# Altium project eRTM15_Baikal.PrjPCB (part 3 of 4)

## Sheet LvpeclTermWithCtrl.SchDoc: =ProjectName
size 420 x 297 mm; Author: SBH; CompanyName: WUT; DrawnBy: SBH; Organization: ISE-WUT; Address1: Warsaw Univeristy of Technology; Address2: Nowowiejska 15/19; DocumentNumber: 9; Revision: -; SheetNumber: 9; SheetTotal: 12; EDA_Number: ARTIQ; Projet: eRTM15 Baikal; ModifiedBy: -; CreateDate: XX/XX/XXXX; CheckedDate: -; Title2: LvpeclTermWithCtrl.SchDoc; DivGrp: ISE; Designer: SBH; ModifiedDate: -; ProjectName: eRTM15 Baikal
Used 43 times, as channels U_Reference_distribution/U_LvpeclTermWithCtrl, U_Reference_distribution/U_LvpeclTermWithCtrl, U_Reference_distribution/U_LvpeclTermWithCtrl, U_Reference_distribution/U_LvpeclTermWithCtrl, U_Reference_distribution/U_LvpeclTermWithCtrl, U_Reference_distribution/U_LvpeclTermWithCtrl, U_Reference_distribution/U_LvpeclTermWithCtrl, U_Reference_distribution/U_LvpeclTermWithCtrl, U_Reference_distribution/U_LvpeclTermWithCtrl, U_Reference_distribution/U_LvpeclTermWithCtrl, U_Reference_distribution/U_LvpeclTermWithCtrl, U_Reference_distribution/U_LvpeclTermWithCtrl, U_Reference_distribution/U_LvpeclTermWithCtrl, U_Reference_distribution/U_LvpeclTermWithCtrl, U_Reference_distribution/U_LvpeclTermWithCtrl, U_Reference_distribution/U_LvpeclTermWithCtrl, U_Reference_distribution/U_LvpeclTermWithCtrl, U_Reference_distribution/U_LvpeclTermWithCtrl, U_Reference_distribution/U_LvpeclTermWithCtrl, U_Reference_distribution/U_LvpeclTermWithCtrl, U_Reference_distribution/U_LvpeclTermWithCtrl, U_Reference_distribution/U_LvpeclTermWithCtrl, U_Reference_distribution/U_LvpeclTermWithCtrl, U_LO_distribution/U_LvpeclTermWithCtrl, U_LO_distribution/U_LvpeclTermWithCtrl, U_LO_distribution/U_LvpeclTermWithCtrl, U_LO_distribution/U_LvpeclTermWithCtrl, U_LO_distribution/U_LvpeclTermWithCtrl, U_LO_distribution/U_LvpeclTermWithCtrl, U_LO_distribution/U_LvpeclTermWithCtrl, U_LO_distribution/U_LvpeclTermWithCtrl, U_LO_distribution/U_LvpeclTermWithCtrl, U_LO_distribution/U_LvpeclTermWithCtrl, U_HF_CLK_Distribution/U_LvpeclTermWithCtrl, U_HF_CLK_Distribution/U_LvpeclTermWithCtrl, U_HF_CLK_Distribution/U_LvpeclTermWithCtrl, U_HF_CLK_Distribution/U_LvpeclTermWithCtrl, U_HF_CLK_Distribution/U_LvpeclTermWithCtrl, U_HF_CLK_Distribution/U_LvpeclTermWithCtrl, U_HF_CLK_Distribution/U_LvpeclTermWithCtrl, U_HF_CLK_Distribution/U_LvpeclTermWithCtrl, U_HF_CLK_Distribution/U_LvpeclTermWithCtrl, U_HF_CLK_Distribution/U_LvpeclTermWithCtrl. Parts and nets are listed once, with the designators drawn on the sheet.
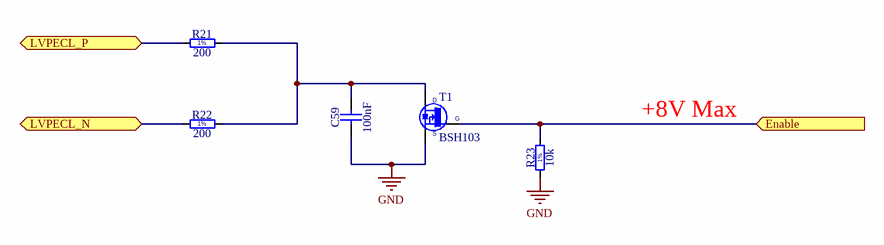
[diagram p7: LvpeclTermWithCtrl.SchDoc]

### Parts
C59  100nF  [CAPC1005X55N]
R21  200  [RESC1005X40N]
R22  200  [RESC1005X40N]
R23  10k  [RESC1005X40N]
T1  BSH103  [SOT95P230X110-3N]

### Ports
Enable (in), LVPECL_N (bidir), LVPECL_P (bidir)

### Nets
GND: C59.1 R23.1 T1.2(S)
Enable: R23.2 T1.1(G) ; port Enable
LVPECL_N: R22.1 ; port LVPECL_N
LVPECL_P: R21.1 ; port LVPECL_P
NetC59_2: C59.2 R21.2 R22.2 T1.3(D)

### Channels
U_Reference_distribution/U_LvpeclTermWithCtrl: designators end in _1; ports Enable=EN4 LVPECL_N=Q2_0_N LVPECL_P=Q2_0_P
U_Reference_distribution/U_LvpeclTermWithCtrl: designators end in _2; ports Enable=EN6 LVPECL_N=Q2_2_N LVPECL_P=Q2_2_P
U_Reference_distribution/U_LvpeclTermWithCtrl: designators end in _3; ports Enable=EN8 LVPECL_N=Q2_4_N LVPECL_P=Q2_4_P
U_Reference_distribution/U_LvpeclTermWithCtrl: designators end in _4; ports Enable=EN10 LVPECL_N=Q2_6_N LVPECL_P=Q2_6_P
U_Reference_distribution/U_LvpeclTermWithCtrl: designators end in _5; ports Enable=EN12 LVPECL_N=Q2_8_N LVPECL_P=Q2_8_P
U_Reference_distribution/U_LvpeclTermWithCtrl: designators end in _6; ports Enable=EN5 LVPECL_N=Q2_1_N LVPECL_P=Q2_1_P
U_Reference_distribution/U_LvpeclTermWithCtrl: designators end in _7; ports Enable=EN7 LVPECL_N=Q2_3_N LVPECL_P=Q2_3_P
U_Reference_distribution/U_LvpeclTermWithCtrl: designators end in _8; ports Enable=EN9 LVPECL_N=Q2_5_N LVPECL_P=Q2_5_P
U_Reference_distribution/U_LvpeclTermWithCtrl: designators end in _9; ports Enable=EN11 LVPECL_N=Q2_7_N LVPECL_P=Q2_7_P
U_Reference_distribution/U_LvpeclTermWithCtrl: designators end in _10; ports Enable=Enable_U_LvpeclTermWithCtrl LVPECL_N=Q2_9_N LVPECL_P=Q2_9_P
U_Reference_distribution/U_LvpeclTermWithCtrl: designators end in _11; ports Enable=Enable_U_LvpeclTermWithCtrl LVPECL_N=Q2_11_N LVPECL_P=Q2_11_P
U_Reference_distribution/U_LvpeclTermWithCtrl: designators end in _12; ports Enable=Enable_U_LvpeclTermWithCtrl LVPECL_N=Q2_10_N LVPECL_P=Q2_10_P
U_Reference_distribution/U_LvpeclTermWithCtrl: designators end in _13; ports Enable=Enable_U_LvpeclTermWithCtrl LVPECL_N=CLKs.4A_N LVPECL_P=CLKs.4A_P
U_Reference_distribution/U_LvpeclTermWithCtrl: designators end in _14; ports Enable=Enable_U_LvpeclTermWithCtrl LVPECL_N=CLKs.6A_N LVPECL_P=CLKs.6A_P
U_Reference_distribution/U_LvpeclTermWithCtrl: designators end in _15; ports Enable=Enable_U_LvpeclTermWithCtrl LVPECL_N=CLKs.8A_N LVPECL_P=CLKs.8A_P
U_Reference_distribution/U_LvpeclTermWithCtrl: designators end in _16; ports Enable=Enable_U_LvpeclTermWithCtrl LVPECL_N=CLKs.10A_N LVPECL_P=CLKs.10A_P
U_Reference_distribution/U_LvpeclTermWithCtrl: designators end in _17; ports Enable=Enable_U_LvpeclTermWithCtrl LVPECL_N=CLKs.12A_N LVPECL_P=CLKs.12A_P
U_Reference_distribution/U_LvpeclTermWithCtrl: designators end in _18; ports Enable=Enable_U_LvpeclTermWithCtrl LVPECL_N=CLKs.14A_P LVPECL_P=CLKs.14A_N
U_Reference_distribution/U_LvpeclTermWithCtrl: designators end in _19; ports Enable=Enable_U_LvpeclTermWithCtrl LVPECL_N=CLKs.5A_N LVPECL_P=CLKs.5A_P
U_Reference_distribution/U_LvpeclTermWithCtrl: designators end in _20; ports Enable=Enable_U_LvpeclTermWithCtrl LVPECL_N=CLKs.7A_P LVPECL_P=CLKs.7A_N
U_Reference_distribution/U_LvpeclTermWithCtrl: designators end in _21; ports Enable=Enable_U_LvpeclTermWithCtrl LVPECL_N=CLKs.9A_N LVPECL_P=CLKs.9A_P
U_Reference_distribution/U_LvpeclTermWithCtrl: designators end in _22; ports Enable=Enable_U_LvpeclTermWithCtrl LVPECL_N=CLKs.11A_N LVPECL_P=CLKs.11A_P
U_Reference_distribution/U_LvpeclTermWithCtrl: designators end in _23; ports Enable=Enable_U_LvpeclTermWithCtrl LVPECL_N=CLKs.13A_N LVPECL_P=CLKs.13A_P
U_LO_distribution/U_LvpeclTermWithCtrl: designators end in _24; ports Enable=EN4 LVPECL_N=Q2_0_N_U_LO_distribution LVPECL_P=Q2_0_P_U_LO_distribution
U_LO_distribution/U_LvpeclTermWithCtrl: designators end in _25; ports Enable=EN6 LVPECL_N=Q2_2_N_U_LO_distribution LVPECL_P=Q2_2_P_U_LO_distribution
U_LO_distribution/U_LvpeclTermWithCtrl: designators end in _26; ports Enable=EN8 LVPECL_N=Q2_4_N_U_LO_distribution LVPECL_P=Q2_4_P_U_LO_distribution
U_LO_distribution/U_LvpeclTermWithCtrl: designators end in _27; ports Enable=EN10 LVPECL_N=Q2_6_N_U_LO_distribution LVPECL_P=Q2_6_P_U_LO_distribution
U_LO_distribution/U_LvpeclTermWithCtrl: designators end in _28; ports Enable=EN12 LVPECL_N=Q2_8_N_U_LO_distribution LVPECL_P=Q2_8_P_U_LO_distribution
U_LO_distribution/U_LvpeclTermWithCtrl: designators end in _29; ports Enable=EN5 LVPECL_N=Q2_1_N_U_LO_distribution LVPECL_P=Q2_1_P_U_LO_distribution
U_LO_distribution/U_LvpeclTermWithCtrl: designators end in _30; ports Enable=EN7 LVPECL_N=Q2_3_N_U_LO_distribution LVPECL_P=Q2_3_P_U_LO_distribution
U_LO_distribution/U_LvpeclTermWithCtrl: designators end in _31; ports Enable=EN9 LVPECL_N=Q2_5_N_U_LO_distribution LVPECL_P=Q2_5_P_U_LO_distribution
U_LO_distribution/U_LvpeclTermWithCtrl: designators end in _32; ports Enable=EN11 LVPECL_N=Q2_7_N_U_LO_distribution LVPECL_P=Q2_7_P_U_LO_distribution
U_LO_distribution/U_LvpeclTermWithCtrl: designators end in _33; ports Enable=Enable_U_LvpeclTermWithCtrl LVPECL_N=Q2_11_N_U_LO_distribution LVPECL_P=Q2_11_P_U_LO_distribution
U_HF_CLK_Distribution/U_LvpeclTermWithCtrl: designators end in _34; ports Enable=EN4 LVPECL_N=Q2_0_N_U_HF_CLK_Distribution LVPECL_P=Q2_0_P_U_HF_CLK_Distribution
U_HF_CLK_Distribution/U_LvpeclTermWithCtrl: designators end in _35; ports Enable=EN6 LVPECL_N=Q2_2_N_U_HF_CLK_Distribution LVPECL_P=Q2_2_P_U_HF_CLK_Distribution
U_HF_CLK_Distribution/U_LvpeclTermWithCtrl: designators end in _36; ports Enable=EN8 LVPECL_N=Q2_4_N_U_HF_CLK_Distribution LVPECL_P=Q2_4_P_U_HF_CLK_Distribution
U_HF_CLK_Distribution/U_LvpeclTermWithCtrl: designators end in _37; ports Enable=EN10 LVPECL_N=Q2_6_N_U_HF_CLK_Distribution LVPECL_P=Q2_6_P_U_HF_CLK_Distribution
U_HF_CLK_Distribution/U_LvpeclTermWithCtrl: designators end in _38; ports Enable=EN12 LVPECL_N=Q2_8_N_U_HF_CLK_Distribution LVPECL_P=Q2_8_P_U_HF_CLK_Distribution
U_HF_CLK_Distribution/U_LvpeclTermWithCtrl: designators end in _39; ports Enable=EN5 LVPECL_N=Q2_1_N_U_HF_CLK_Distribution LVPECL_P=Q2_1_P_U_HF_CLK_Distribution
U_HF_CLK_Distribution/U_LvpeclTermWithCtrl: designators end in _40; ports Enable=EN7 LVPECL_N=Q2_3_N_U_HF_CLK_Distribution LVPECL_P=Q2_3_P_U_HF_CLK_Distribution
U_HF_CLK_Distribution/U_LvpeclTermWithCtrl: designators end in _41; ports Enable=EN9 LVPECL_N=Q2_5_N_U_HF_CLK_Distribution LVPECL_P=Q2_5_P_U_HF_CLK_Distribution
U_HF_CLK_Distribution/U_LvpeclTermWithCtrl: designators end in _42; ports Enable=EN11 LVPECL_N=Q2_7_N_U_HF_CLK_Distribution LVPECL_P=Q2_7_P_U_HF_CLK_Distribution
U_HF_CLK_Distribution/U_LvpeclTermWithCtrl: designators end in _43; ports Enable=Enable_U_LvpeclTermWithCtrl LVPECL_N=Q2_11_N_U_HF_CLK_Distribution LVPECL_P=Q2_11_P_U_HF_CLK_Distribution

### Notes on the sheet
- +8V Max
- Project/Equipment
- Document
- Designer
- Drawn by
- Check.by
- File
- Last Mod.
- Print Date
- Sheet
- Size
- A3
- of
- Rev
- (in symbol R0402_10K_1%_0.0625W_100PPM) 1%
- (in symbol R0402_200R_1%_0.0625W_100PPM) 1%

### Library data of the parts
C59 = CC0402_100NF_16V_10%_X7R: Non-polarised capacitor; Part Description: SMD Multilayer Chip Ceramic Capacitor; Manufacturer: GENERIC; Manufacturer1 Part Number: GRM155R71C104KA88D; Voltage: 16V; TC: X7R; Tolerance: ±10%; Part Number: CC0402_100NF_16V_10%_X7R; Component Kind: Standard; Component Type: Standard; Pin Count: 2; Value: 100nF; Status: Not Recommended; Manufacturer Part Number: CC0402_100NF_16V_10%_X7R; Case: 0402; Mounted: Yes; Socket: No; SMD: Yes; Sense: No; Manufacturer1 Example: MURATA; Manufacturer1 ComponentHeight: 0.55mm; HelpURL: \\cern.ch\dfs\Applications\Altium\Datasheets\CC0402_X7R_MURATA_GRM.pdf; Author: CERN DEM JLC; CreateDate: 2013-12-05; LatestRevisionDate: 2007-12-03
R21 R22 = R0402_200R_1%_0.0625W_100PPM: Resistor - 1%; Part Description: General Purpose Thick Film Chip Resistor; Manufacturer: GENERIC; Manufacturer1 Part Number: 232270672001L; TC: ±100ppm/°C; Part Number: R0402_200R_1%_0.0625W_100PPM; Component Kind: Standard; Component Type: Standard; Pin Count: 2; Value: 200; Status: Not recommended; Power: 0.0625W; Tolerance: ±1%; Manufacturer Part Number: R0402_200R_1%_0.0625W_100PPM; Case: 0402; Mounted: Yes; Sense: No; Socket: No; SMD: Yes; Manufacturer1 Example: YAGEO PHYCOMP; Manufacturer1 ComponentHeight: 0.4mm; HelpURL: \\cern.ch\dfs\Applications\Altium\Datasheets\R0402_Phycomp_RC0402.pdf; Author: CERN DEM JLC; CreateDate: 2007-12-03; LatestRevisionDate: 2012-10-17
R23 = R0402_10K_1%_0.0625W_100PPM: Resistor - 1%; Part Description: General Purpose Thick Film Chip Resistor; Manufacturer: GENERIC; Manufacturer1 Part Number: 232270671003L; TC: ±100ppm/°C; Part Number: R0402_10K_1%_0.0625W_100PPM; Component Kind: Standard; Component Type: Standard; Pin Count: 2; Value: 10k; Status: Not recommended; Power: 0.0625W; Tolerance: ±1%; Manufacturer Part Number: R0402_10K_1%_0.0625W_100PPM; Case: 0402; Mounted: Yes; Sense: No; Socket: No; SMD: Yes; Manufacturer1 Example: YAGEO PHYCOMP; Manufacturer1 ComponentHeight: 0.4mm; HelpURL: \\cern.ch\dfs\Applications\Altium\Datasheets\R0402_Phycomp_RC0402.pdf; Author: CERN DEM JLC; CreateDate: 2007-12-03; LatestRevisionDate: 2012-10-17
T1 = BSH103: N-CHANNEL MOSFET WITH DIODE; Part Description: 30V 850mA N-Channel Enhancement Mode Field-Effect Transistor; Manufacturer: NXP SEMICONDUCTORS; PressFit: No; Bonding: No; Part Number: BSH103; Component Kind: Standard; Component Type: Standard; Device: BSH103; PackageDescription: SOT23, 3 pin, Pitch 0.95mm - 1.3mm W X 2.9mm L X 1.1mm H, IPC Medium Density; Manufacturer Part Number: BSH103; Pin Count: 3; Case: SOT23-3; Mounted: Yes; Socket: No; SMD: Yes; Sense: No; ComponentHeight: 1.1mm; HelpURL: \\cern.ch\dfs\Applications\Altium\Datasheets\BSH103.pdf; Author: CERN DEM JLC; CreateDate: 2010-03-16; LatestRevisionDate: 2012-02-01

## Sheet OnBoardOsc.SchDoc: =ProjectName
size 420 x 297 mm; Author: SBH; CompanyName: WUT; DrawnBy: SBH; Organization: ISE-WUT; Address1: Warsaw Univeristy of Technology; Address2: Nowowiejska 15/19; DocumentNumber: 5; Revision: -; SheetNumber: 5; SheetTotal: 12; EDA_Number: ARTIQ; Projet: eRTM15 Baikal; ModifiedBy: -; CreateDate: XX/XX/XXXX; CheckedDate: -; Title2: OnBoardOsc.SchDoc; DivGrp: ISE; Designer: SBH; ModifiedDate: -; ProjectName: eRTM15 Baikal
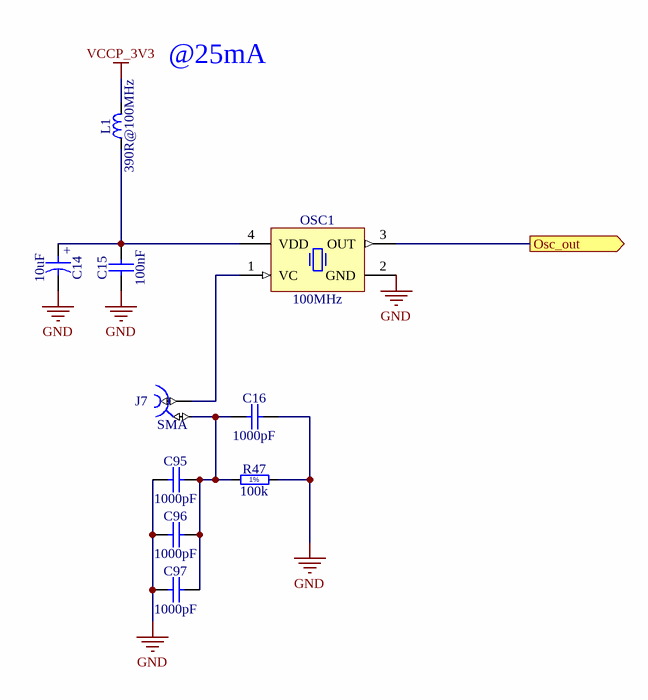
[diagram p8: OnBoardOsc.SchDoc]

### Parts
C14  10uF  [CAPMP3216X180N]
C15  100nF  [CAPC1005X55N]
C16  1000pF  [CAPC1005X55N]
C95  1000pF  [CAPC1005X55N]
C96  1000pF  [CAPC1005X55N]
C97  1000pF  [CAPC1005X55N]
J7  SMA  [HUBER-SUHNER_82_SMA-50-0-41/133_NE]
L1  390R@100MHz  [INDC1608X95N]
OSC1  100MHz  [OSC_CRYSTEK_CVHD-950]
R47  100k  [RESC1005X40N]

### Ports
Osc_out (out)

### Nets
GND: C14.2 C15.1 C16.2 C95.1 C96.1 C97.1 OSC1.2(GND) R47.2
VCCP_3V3: L1.2
Osc_out: OSC1.3(OUT) ; port Osc_out
NetC14_1: C14.1 C15.2 L1.1 OSC1.4(VDD)
NetC16_1: C16.1 C95.2 C96.2 C97.2 J7.2 R47.1
NetJ7_1: J7.1 OSC1.1(VC)

### Notes on the sheet
- @25mA
- Project/Equipment
- Document
- Designer
- Drawn by
- Check.by
- File
- Last Mod.
- Print Date
- Sheet
- Size
- A3
- of
- Rev
- (in symbol CTE3216-18_10UF_10V_10%_LESR1800) +
- (in symbol R0402_4K7_1%_0.0625W_100PPM) 1%

### Library data of the parts
C14 = CTE3216-18_10UF_10V_10%_LESR1800: Polarised capacitor; Part Description: Low ESR 1R8 Solid Tantalum Chip Capacitor; Manufacturer: GENERIC; Manufacturer1 Part Number: TPSA106K010R1800; Voltage: 10V; Tolerance: ±10%; Part Number: CTE3216-18_10UF_10V_10%_LESR1800; Component Kind: Standard; Component Type: Standard; Pin Count: 2; Value: 10uF; Status: Preferred; Manufacturer Part Number: CTE3216-18_10UF_10V_10%_LESR1800; Case: A; Mounted: Yes; Socket: No; SMD: Yes; Sense: No; Manufacturer1 Example: AVX; Manufacturer1 ComponentHeight: 1.8mm; HelpURL: \\cern.ch\dfs\Applications\Altium\Datasheets\CTE-LESR_AVX_TPS.pdf; Author: CERN DEM JLC; CreateDate: 2008-05-05; LatestRevisionDate: 2009-01-20
C15 = CC0402_100NF_16V_10%_X7R: as C59 on sheet LvpeclTermWithCtrl; Part Number: CC0402_100NF_16V_10%_X7R; Component Kind: Standard; Component Type: Standard; Pin Count: 2; Value: 100nF; Status: Not Recommended; Manufacturer Part Number: CC0402_100NF_16V_10%_X7R; Case: 0402; Mounted: Yes; Socket: No; SMD: Yes; Sense: No; Manufacturer1 Example: MURATA; Manufacturer1 ComponentHeight: 0.55mm; HelpURL: \\cern.ch\dfs\Applications\Altium\Datasheets\CC0402_X7R_MURATA_GRM.pdf; Author: CERN DEM JLC; CreateDate: 2013-12-05; LatestRevisionDate: 2007-12-03
C16 C95-C97 = CC0402_100PF_50V_5%_C0G: Non-polarised capacitor; Part Number: CC0402_1000PF_50V_5%_C0G; Part Description: SMD Multilayer Chip Ceramic Capacitor; Manufacturer: GENERIC; Manufacturer1 Part Number: C0402C102J5RACTU; Voltage: 50V; TC: C0G/NP0; Tolerance: ±5%; Component Kind: Standard; Component Type: Standard; Pin Count: 2; Value: 1000pF; Status: Preferred; Manufacturer Part Number: CC0402_100PF_50V_5%_C0G; Case: 0402; Mounted: Yes; Socket: No; SMD: Yes; Sense: No; Manufacturer1 Example: KEMET; Manufacturer1 ComponentHeight: 0.55mm; HelpURL: \\cern.ch\dfs\Applications\Altium\Datasheets\CC0805_C0G_KEMET_(Commercial Grade).pdf; Author: CERN DEM JLC; CreateDate: 2007-12-03; LatestRevisionDate: 2015-04-22
J7 = HUBER-SUHNER_82_SMA-50-0-41/133_NE: Part Description: SMA 50 Ohms Straight PCB Jack; Manufacturer: HUBER+SUHNER; PressFit: No; Part Number: HUBER-SUHNER_82_SMA-50-0-41/133_NE; Component Kind: Standard; Component Type: Standard; Pin Count: 2; Family: SMA; Mounted: Yes; Socket: No; SMD: No; Sense: No; Status: None; Manufacturer Part Number: 82_SMA-50-0-41/133_NE; ComponentHeight: 9.6mm; HelpURL: \\cern.ch\dfs\Applications\Altium\Datasheets\HUBER-SUHNER_82_SMA-50-0-41-133_NE.pdf; Author: CERN DEM JLC; CreateDate: 2010-04-20; LatestRevisionDate: 2014-11-06
L1 = IND0603_TDK_MPZ1608R391A: Inductor; Part Description: SMT Chip Bead for Power Line; Manufacturer: TDK; Power: 1.2A; Resistance: 0.12R; Tolerance: ±25%; Part Number: IND0603_TDK_MPZ1608R391A; Component Kind: Standard; Component Type: Standard; Pin Count: 2; Value: 390R@100MHz; Status: None; Manufacturer Part Number: MPZ1608R391A; Case: 0603; Mounted: Yes; Socket: No; SMD: Yes; Sense: No; ComponentHeight: 0.95mm; HelpURL: \\cern.ch\dfs\Applications\Altium\Datasheets\IND0603_TDK_MPZ1608.pdf; Author: CERN DEM JLC; CreateDate: 2009-12-02; LatestRevisionDate: 2009-12-02
OSC1 = OSC_100MHZ_CRYSTEK_CVHD-950-100.000: Oscillator 4 pins 1=VC 2=GND 3=OUT 4=VDD; Part Description: 3.3V, ±20ppm, 15pF, 0..70°C, CMOS Surface Mount Ultra-Low Noise Oscillator (CVHD-950 Series); Manufacturer: CRYSTEK CRYSTAL; PressFit: No; Bonding: No; Part Number: OSC_100MHZ_CRYSTEK_CVHD-950-100.000; Component Kind: Standard; Component Type: Standard; PackageDescription: Oscillator, 5.08mm Pitch; 4 Pin, 14.2mm L X 9.14mm W X 5.3mm H, CVHD-950 Serie; Value: 100MHz; Manufacturer Part Number: CVHD-950-100.000; Pin Count: 4; Mounted: Yes; Socket: No; SMD: Yes; Sense: No; ComponentHeight: 5.3mm; HelpURL: \\cern.ch\dfs\Applications\Altium\Datasheets\OSC_CRYSTEK_CVHD-950.pdf; Author: CERN DEM BC; CreateDate: 2016-11-04; LatestRevisionDate: 2016-11-04
R47 = R0402_4K7_1%_0.0625W_100PPM: Resistor - 1%; Part Number: R0402_100k_1%_0.0625W_100PPM; Part Description: General Purpose Thick Film Chip Resistor; Manufacturer: GENERIC; Manufacturer1 Part Number: RC0402FR-07100KL; TC: ±100ppm/°C; Component Kind: Standard; Component Type: Standard; Pin Count: 2; Value: 100k; Status: Not recommended; Power: 0.0625W; Tolerance: ±1%; Manufacturer Part Number: R0402_4K7_1%_0.0625W_100PPM; Case: 0402; Mounted: Yes; Sense: No; Socket: No; SMD: Yes; Manufacturer1 Example: YAGEO PHYCOMP; Manufacturer1 ComponentHeight: 0.4mm; HelpURL: \\cern.ch\dfs\Applications\Altium\Datasheets\R0402_Phycomp_RC0402.pdf; Author: CERN DEM JLC; CreateDate: 2007-12-03; LatestRevisionDate: 2012-10-17

## Sheet Signal_distribution.SchDoc: =ProjectName
size 420 x 297 mm; Author: SBH; CompanyName: WUT; DrawnBy: SBH; Organization: ISE-WUT; Address1: Warsaw Univeristy of Technology; Address2: Nowowiejska 15/19; DocumentNumber: 6; Revision: -; SheetNumber: 6; SheetTotal: 12; EDA_Number: ARTIQ; Projet: eRTM15 Baikal; ModifiedBy: -; CreateDate: XX/XX/XXXX; CheckedDate: -; Title2: Signal_distribution.SchDoc; DivGrp: ISE; Designer: SBH; ModifiedDate: -; ProjectName: eRTM15 Baikal
Used 2 times, as channels U_LO_distribution, U_HF_CLK_Distribution. Parts and nets are listed once, with the designators drawn on the sheet.
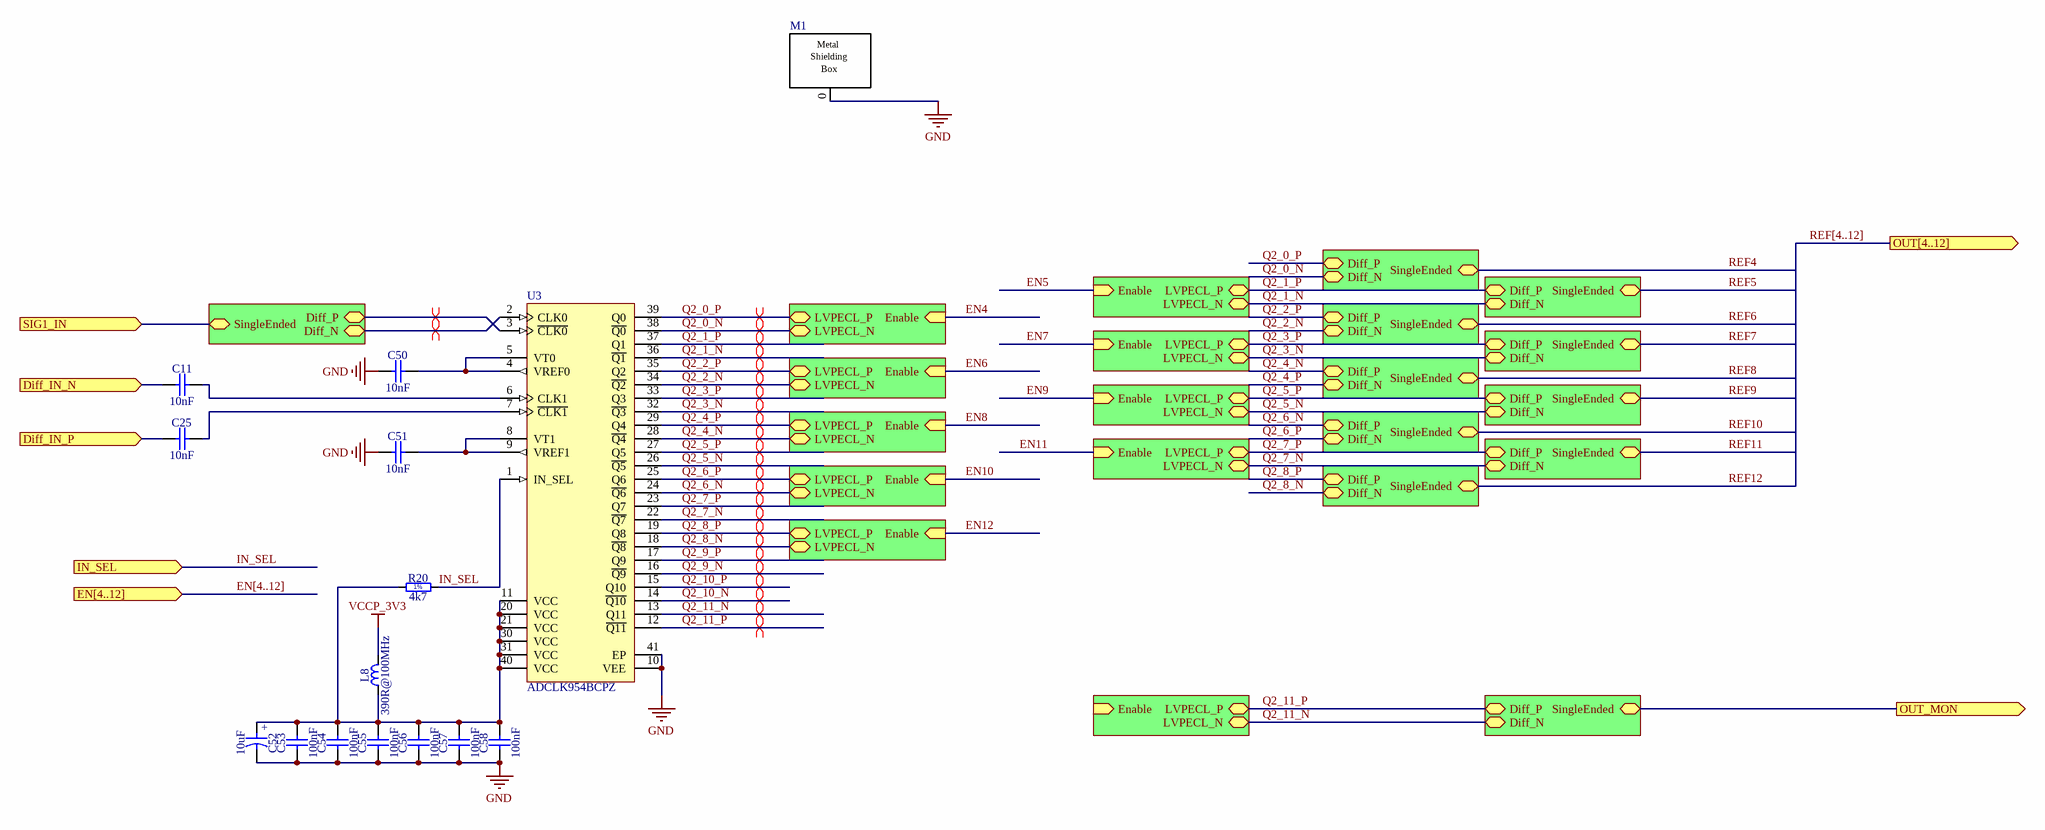
[diagram p9: Signal_distribution.SchDoc]

### Parts
C11  10nF  [CAPC1005X55N]
C25  10nF  [CAPC1005X55N]
C50  10nF  [CAPC1005X55N]
C51  10nF  [CAPC1005X55N]
C52  10uF  [CAPMP3216X180N]
C53  100nF  [CAPC1005X55N]
C54  100nF  [CAPC1005X55N]
C55  100nF  [CAPC1005X55N]
C56  100nF  [CAPC1005X55N]
C57  100nF  [CAPC1005X55N]
C58  100nF  [CAPC1005X55N]
L8  390R@100MHz  [INDC1608X95N]
M1  Shield  [BMI-S-202-F]  (value not drawn)
R20  4k7  [RESC1005X40N]
U3  ADCLK954BCPZ  [ADI-CP-40-8_M]

### Sub-sheets
U_Diff2SE = Diff2SE.SchDoc: Diff_P, Diff_N, SingleEnded
U_Diff2SE = Diff2SE.SchDoc: Diff_P, Diff_N, SingleEnded
U_Diff2SE = Diff2SE.SchDoc: Diff_P, Diff_N, SingleEnded
U_Diff2SE = Diff2SE.SchDoc: Diff_P, Diff_N, SingleEnded
U_Diff2SE = Diff2SE.SchDoc: Diff_P, Diff_N, SingleEnded
U_Diff2SE = Diff2SE.SchDoc: Diff_P, Diff_N, SingleEnded
U_Diff2SE = Diff2SE.SchDoc: Diff_P, Diff_N, SingleEnded
U_Diff2SE = Diff2SE.SchDoc: Diff_P, Diff_N, SingleEnded
U_Diff2SE = Diff2SE.SchDoc: Diff_P, Diff_N, SingleEnded
U_Diff2SE = Diff2SE.SchDoc: Diff_P, Diff_N, SingleEnded
U_Diff2SE = Diff2SE.SchDoc: Diff_P, Diff_N, SingleEnded
U_LvpeclTermWithCtrl = LvpeclTermWithCtrl.SchDoc: LVPECL_P (bidir), LVPECL_N (bidir), Enable (in)
U_LvpeclTermWithCtrl = LvpeclTermWithCtrl.SchDoc: LVPECL_P (bidir), LVPECL_N (bidir), Enable (in)
U_LvpeclTermWithCtrl = LvpeclTermWithCtrl.SchDoc: LVPECL_P (bidir), LVPECL_N (bidir), Enable (in)
U_LvpeclTermWithCtrl = LvpeclTermWithCtrl.SchDoc: LVPECL_P (bidir), LVPECL_N (bidir), Enable (in)
U_LvpeclTermWithCtrl = LvpeclTermWithCtrl.SchDoc: LVPECL_P (bidir), LVPECL_N (bidir), Enable (in)
U_LvpeclTermWithCtrl = LvpeclTermWithCtrl.SchDoc: LVPECL_P (bidir), LVPECL_N (bidir), Enable (in)
U_LvpeclTermWithCtrl = LvpeclTermWithCtrl.SchDoc: LVPECL_P (bidir), LVPECL_N (bidir), Enable (in)
U_LvpeclTermWithCtrl = LvpeclTermWithCtrl.SchDoc: LVPECL_P (bidir), LVPECL_N (bidir), Enable (in)
U_LvpeclTermWithCtrl = LvpeclTermWithCtrl.SchDoc: LVPECL_P (bidir), LVPECL_N (bidir), Enable (in)
U_LvpeclTermWithCtrl = LvpeclTermWithCtrl.SchDoc: LVPECL_P (bidir), LVPECL_N (bidir), Enable (in)

### Ports
Diff_IN_N (in), Diff_IN_P (in), EN[4..12] (in), IN_SEL (in), OUT[4..12] (out), OUT_MON (out), SIG1_IN (in)

### Nets
GND: C50.1 C51.1 C52.2 C53.1 C54.1 C55.1 C56.1 C57.1 C58.1 M1.0(SHIELD) U3.10(VEE) U3.41(EP)
VCCP_3V3: L8.2
Diff_IN_N: C11.1 ; port Diff_IN_N
Diff_IN_P: C25.1 ; port Diff_IN_P
IN_SEL: R20.2 U3.1(IN_SEL) ; port IN_SEL
OUT_MON: port OUT_MON, sheet U_Diff2SE/SingleEnded
Q2_0_N: U3.38(~{Q0}) ; sheet U_Diff2SE/Diff_N, sheet U_LvpeclTermWithCtrl/LVPECL_N
Q2_0_P: U3.39(Q0) ; sheet U_Diff2SE/Diff_P, sheet U_LvpeclTermWithCtrl/LVPECL_P
Q2_1_N: U3.36(~{Q1}) ; sheet U_Diff2SE/Diff_N, sheet U_LvpeclTermWithCtrl/LVPECL_N
Q2_1_P: U3.37(Q1) ; sheet U_Diff2SE/Diff_P, sheet U_LvpeclTermWithCtrl/LVPECL_P
Q2_2_N: U3.34(~{Q2}) ; sheet U_Diff2SE/Diff_N, sheet U_LvpeclTermWithCtrl/LVPECL_N
Q2_2_P: U3.35(Q2) ; sheet U_Diff2SE/Diff_P, sheet U_LvpeclTermWithCtrl/LVPECL_P
Q2_3_N: U3.32(~{Q3}) ; sheet U_Diff2SE/Diff_N, sheet U_LvpeclTermWithCtrl/LVPECL_N
Q2_3_P: U3.33(Q3) ; sheet U_Diff2SE/Diff_P, sheet U_LvpeclTermWithCtrl/LVPECL_P
Q2_4_N: U3.28(~{Q4}) ; sheet U_Diff2SE/Diff_P, sheet U_LvpeclTermWithCtrl/LVPECL_N
Q2_4_P: U3.29(Q4) ; sheet U_Diff2SE/Diff_N, sheet U_LvpeclTermWithCtrl/LVPECL_P
Q2_5_N: U3.26(~{Q5}) ; sheet U_Diff2SE/Diff_N, sheet U_LvpeclTermWithCtrl/LVPECL_N
Q2_5_P: U3.27(Q5) ; sheet U_Diff2SE/Diff_P, sheet U_LvpeclTermWithCtrl/LVPECL_P
Q2_6_N: U3.24(~{Q6}) ; sheet U_Diff2SE/Diff_P, sheet U_LvpeclTermWithCtrl/LVPECL_N
Q2_6_P: U3.25(Q6) ; sheet U_Diff2SE/Diff_N, sheet U_LvpeclTermWithCtrl/LVPECL_P
Q2_7_N: U3.22(~{Q7}) ; sheet U_Diff2SE/Diff_N, sheet U_LvpeclTermWithCtrl/LVPECL_N
Q2_7_P: U3.23(Q7) ; sheet U_Diff2SE/Diff_P, sheet U_LvpeclTermWithCtrl/LVPECL_P
Q2_8_N: U3.18(~{Q8}) ; sheet U_Diff2SE/Diff_N, sheet U_LvpeclTermWithCtrl/LVPECL_N
Q2_8_P: U3.19(Q8) ; sheet U_Diff2SE/Diff_P, sheet U_LvpeclTermWithCtrl/LVPECL_P
Q2_9_N: U3.16(~{Q9})
Q2_9_P: U3.17(Q9)
Q2_10_N: U3.14(~{Q10})
Q2_10_P: U3.15(Q10)
Q2_11_N: U3.13(Q11) ; sheet U_Diff2SE/Diff_N, sheet U_LvpeclTermWithCtrl/LVPECL_N
Q2_11_P: U3.12(~{Q11}) ; sheet U_Diff2SE/Diff_P, sheet U_LvpeclTermWithCtrl/LVPECL_P
SIG1_IN: port SIG1_IN, sheet U_Diff2SE/SingleEnded
NetC11_2: C11.2 U3.6(CLK1)
NetC25_2: C25.2 U3.7(~{CLK1})
NetC50_2: C50.2 U3.4(VREF0) U3.5(VT0)
NetC51_2: C51.2 U3.8(VT1) U3.9(VREF1)
NetC52_1: C52.1 C53.2 C54.2 C55.2 C56.2 C57.2 C58.2 L8.1 R20.1 U3.11(VCC) U3.20(VCC) U3.21(VCC) U3.30(VCC) U3.31(VCC) U3.40(VCC)
NetU3_2: U3.2(CLK0) ; sheet U_Diff2SE/Diff_N
NetU3_3: U3.3(~{CLK0}) ; sheet U_Diff2SE/Diff_P

### Channels
U_LO_distribution: designators end in _1; ports Diff_IN_N=REF_LO_OUT_N Diff_IN_P=REF_LO_OUT_P IN_SEL=IN_SEL OUT_MON=LO_OUT SIG1_IN=LO_IN
U_HF_CLK_Distribution: designators end in _2; ports Diff_IN_N=HF_CLK_OUT_N Diff_IN_P=HF_CLK_OUT_P IN_SEL=IN_SEL OUT_MON=HF_CLK_OUT SIG1_IN=HF_CLK_IN

### Buses and harness runs
bus EN[4..12] = port EN[4..12]
bus REF[4..12] = port OUT[4..12]

### Layout directives
differential pair: Diff_N, Diff_P, Q2_0_N_U_LO_distribution, Q2_0_P_U_LO_distribution, Q2_1_N_U_LO_distribution, Q2_1_P_U_LO_distribution, Q2_2_N_U_LO_distribution, Q2_2_P_U_LO_distribution, Q2_3_N_U_LO_distribution, Q2_3_P_U_LO_distribution, Q2_4_N_U_LO_distribution, Q2_4_P_U_LO_distribution, Q2_5_N_U_LO_distribution, Q2_5_P_U_LO_distribution, Q2_6_N_U_LO_distribution, Q2_6_P_U_LO_distribution, Q2_7_N_U_LO_distribution, Q2_7_P_U_LO_distribution, Q2_8_N_U_LO_distribution, Q2_8_P_U_LO_distribution, Q2_9_N_U_LO_distribution, Q2_9_P_U_LO_distribution, Q2_10_N_U_LO_distribution, Q2_10_P_U_LO_distribution, Q2_11_N_U_LO_distribution, Q2_11_P_U_LO_distribution

### Notes on the sheet
- Project/Equipment
- Document
- Designer
- Drawn by
- Check.by
- File
- Last Mod.
- Print Date
- Sheet
- Size
- A3
- of
- Rev
- (in symbol BMI-S-202-F) Metal; Shielding; Box
- (in symbol CTE3216-18_10UF_10V_10%_LESR1800) +
- (in symbol R0402_4K7_1%_0.0625W_100PPM) 1%

### Library data of the parts
C11 C25 C50 C51 = CC0402_10NF_16V_10%_X7R: Non-polarised capacitor; Part Description: SMD Multilayer Chip Ceramic Capacitor; Manufacturer: GENERIC; Manufacturer1 Part Number: 223878715636; Voltage: 16V; TC: X7R; Tolerance: ±10%; Part Number: CC0402_10NF_16V_10%_X7R; Component Kind: Standard; Component Type: Standard; Pin Count: 2; Value: 10nF; Status: Not Recommended; Manufacturer Part Number: CC0402_10NF_16V_10%_X7R; Case: 0402; Mounted: Yes; Socket: No; SMD: Yes; Sense: No; Manufacturer1 Example: PHYCOMP; Manufacturer1 ComponentHeight: 0.55mm; HelpURL: \\cern.ch\dfs\Applications\Altium\Datasheets\CC0402_X7R_PHYCOMP.pdf; Author: CERN DEM JLC; CreateDate: 2007-12-03; LatestRevisionDate: 2007-12-03
C52 = CTE3216-18_10UF_10V_10%_LESR1800: as C14 on sheet OnBoardOsc; Part Number: CTE3216-18_10UF_10V_10%_LESR1800; Component Kind: Standard; Component Type: Standard; Pin Count: 2; Value: 10uF; Status: Preferred; Manufacturer Part Number: CTE3216-18_10UF_10V_10%_LESR1800; Case: A; Mounted: Yes; Socket: No; SMD: Yes; Sense: No; Manufacturer1 Example: AVX; Manufacturer1 ComponentHeight: 1.8mm; HelpURL: \\cern.ch\dfs\Applications\Altium\Datasheets\CTE-LESR_AVX_TPS.pdf; Author: CERN DEM JLC; CreateDate: 2008-05-05; LatestRevisionDate: 2009-01-20
C53-C58 = CC0402_100NF_16V_10%_X7R: as C59 on sheet LvpeclTermWithCtrl; Part Number: CC0402_100NF_16V_10%_X7R; Component Kind: Standard; Component Type: Standard; Pin Count: 2; Value: 100nF; Status: Not Recommended; Manufacturer Part Number: CC0402_100NF_16V_10%_X7R; Case: 0402; Mounted: Yes; Socket: No; SMD: Yes; Sense: No; Manufacturer1 Example: MURATA; Manufacturer1 ComponentHeight: 0.55mm; HelpURL: \\cern.ch\dfs\Applications\Altium\Datasheets\CC0402_X7R_MURATA_GRM.pdf; Author: CERN DEM JLC; CreateDate: 2013-12-05; LatestRevisionDate: 2007-12-03
L8 = IND0603_TDK_MPZ1608R391A: as L1 on sheet OnBoardOsc; Part Number: IND0603_TDK_MPZ1608R391A; Component Kind: Standard; Component Type: Standard; Pin Count: 2; Value: 390R@100MHz; Status: None; Manufacturer Part Number: MPZ1608R391A; Case: 0603; Mounted: Yes; Socket: No; SMD: Yes; Sense: No; ComponentHeight: 0.95mm; HelpURL: \\cern.ch\dfs\Applications\Altium\Datasheets\IND0603_TDK_MPZ1608.pdf; Author: CERN DEM JLC; CreateDate: 2009-12-02; LatestRevisionDate: 2009-12-02
M1 = BMI-S-202-F: STANDARD SURFACE MOUNT SHIELD  TWO-PIECE PART NO. BMI-S-202; Manufacturer: Laird Technologies; Remark: part 1 - gasket, part 2 - cover; Manufacturer part name: BMI-S-202-F; Supplier: Mouser; Mounting type: SMT; Supplier part 1 number: 739-BMIS-202-F; Supplier part 2 number: 739-BMIS-202-C
R20 = R0402_4K7_1%_0.0625W_100PPM: Resistor - 1%; Part Description: General Purpose Thick Film Chip Resistor; Manufacturer: GENERIC; Manufacturer1 Part Number: 232270674702L; TC: ±100ppm/°C; Part Number: R0402_4K7_1%_0.0625W_100PPM; Component Kind: Standard; Component Type: Standard; Pin Count: 2; Value: 4k7; Status: Not recommended; Power: 0.0625W; Tolerance: ±1%; Manufacturer Part Number: R0402_4K7_1%_0.0625W_100PPM; Case: 0402; Mounted: Yes; Sense: No; Socket: No; SMD: Yes; Manufacturer1 Example: YAGEO PHYCOMP; Manufacturer1 ComponentHeight: 0.4mm; HelpURL: \\cern.ch\dfs\Applications\Altium\Datasheets\R0402_Phycomp_RC0402.pdf; Author: CERN DEM JLC; CreateDate: 2007-12-03; LatestRevisionDate: 2012-10-17
U3 = CMP-0884-00036-1: 2 Selectable Inputs, 12 LVPECL Outputs, SiGe Clock Fanout Buffer, 3.3 V Supply, Industrial, 40-pin QFN (CP-40-8), Tray; Manufacturer: Analog Devices; Supply Voltage (V): 3.3; # of Outputs: 12; On-Chip VCO or DCO: No; Max f-out: 4.8 GHz; # of Inputs: 2; I/O Interface: Pin Select; PackageVersion: 082708-A, 08/2008; DatasheetVersion: Rev. B; Output Logic: LVPECL; PackageReference: CP-40-8; Mounting Technology: Surface Mount; ComponentLink1Description: Manufacturer URL; ComponentLink2Description: Datasheet; ComponentLink4URL: http://www.analog.com/en/clock-and-timing/clock-generation-and-distribution/adclk954/products/product.html; Code_JEDEC: MO-220-VJJD-2; ComponentLink2URL: http://www.analog.com/static/imported-files/data_sheets/ADCLK954.pdf; ComponentLink1URL: http://www.analog.com/en/index.html; ComponentLink4Description: Product URL; PartNumber: ADCLK954BCPZ; ComponentLink3URL: http:/www.analog.com/static/imported-files/packages/PKG_PDF/LFCSP(CP)/CP_40_8.pdf; PackageDescription: 40-Pin Lead Frame Chip Scale Package, Body 6 x 6 mm, Pitch 0.5 mm; Packing: Tray; ComponentLink3Description: Package Specification

## Sheet CTRL.SchDoc: =ProjectName
size 420 x 297 mm; Author: SBH; CompanyName: WUT; DrawnBy: SBH; Organization: ISE-WUT; Address1: Warsaw Univeristy of Technology; Address2: Nowowiejska 15/19; DocumentNumber: 11; Revision: -; SheetNumber: 11; SheetTotal: 12; EDA_Number: ARTIQ; Projet: eRTM15 Baikal; ModifiedBy: -; CreateDate: XX/XX/XXXX; CheckedDate: -; Title2: CTRL.SchDoc; DivGrp: ISE; Designer: SBH; ModifiedDate: -; ProjectName: eRTM15 Baikal
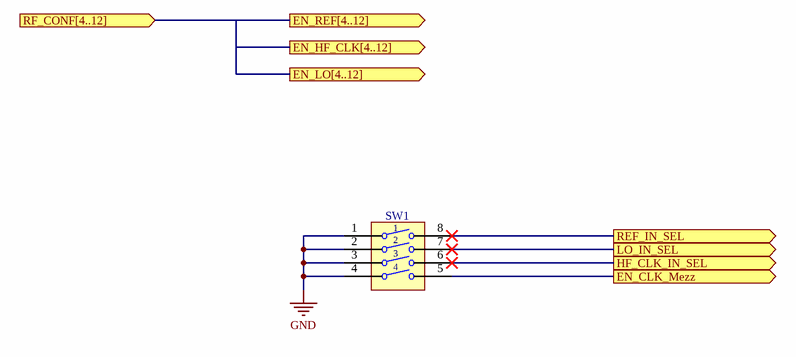
[diagram p10: CTRL.SchDoc]

### Parts
SW1  Switch  [SW_CTS_219-4MST]  (value not drawn)

### Ports
EN_CLK_Mezz (out), EN_HF_CLK[4..12] (out), EN_LO[4..12] (out), EN_REF[4..12] (out), HF_CLK_IN_SEL (out), LO_IN_SEL (out), REF_IN_SEL (out), RF_CONF[4..12] (in)

### Nets
GND: SW1.1 SW1.2 SW1.3 SW1.4
EN_CLK_Mezz: SW1.5 ; port EN_CLK_Mezz
IN_SEL: SW1.8 ; port REF_IN_SEL
IN_SEL: SW1.7 ; port LO_IN_SEL  [a separate net that carries the same name]
IN_SEL: SW1.6 ; port HF_CLK_IN_SEL  [a separate net that carries the same name]

### Buses and harness runs
bus port EN_HF_CLK[4..12] = port EN_LO[4..12] = port EN_REF[4..12] = port RF_CONF[4..12]

### Notes on the sheet
- Project/Equipment
- Document
- Designer
- Drawn by
- Check.by
- File
- Last Mod.
- Print Date
- Sheet
- Size
- A3
- of
- Rev

### Library data of the parts
SW1 = SW_CTS_219-4MST: 4 Ways SPST DIP Switch; Part Description: 4 Ways, Pitch 2.54mm, SPST DIP Switch, Rating 100mA 50VDC; Manufacturer: CTS ELECTROCOMPONENTS; PressFit: No; Part Number: SW_CTS_219-4MST; Component Kind: Standard; Component Type: Standard; Pin Count: 8; PackageDescription: Pitch 2.54mm, Body 6.7 x 11.63mm, 4 Ways SPST Surface-Mounting DIP Switch, CTS 219 Series; Family: Switch; Mounted: Yes; Socket: No; SMD: Yes; Sense: No; Status: None; Manufacturer Part Number: 219-4MST; ComponentHeight: 2.23mm; HelpURL: \\cern.ch\dfs\Applications\Altium\Datasheets\SW_CTS_219-4MST.pdf; Author: CERN DEM JLC; CreateDate: 2014-11-17; LatestRevisionDate: 2014-11-17

## Sheet PowerSupply4ClkMezzanine.SchDoc: =ProjectName
size 420 x 297 mm; Author: SBH; CompanyName: WUT; DrawnBy: SBH; Organization: ISE-WUT; Address1: Warsaw Univeristy of Technology; Address2: Nowowiejska 15/19; DocumentNumber: 12; Revision: -; SheetNumber: 12; SheetTotal: 12; EDA_Number: ARTIQ; Projet: eRTM15 Baikal; ModifiedBy: -; CreateDate: XX/XX/XXXX; CheckedDate: -; Title2: PowerSupply4ClkMezzanine.SchDoc; DivGrp: ISE; Designer: SBH; ModifiedDate: -; ProjectName: eRTM15 Baikal
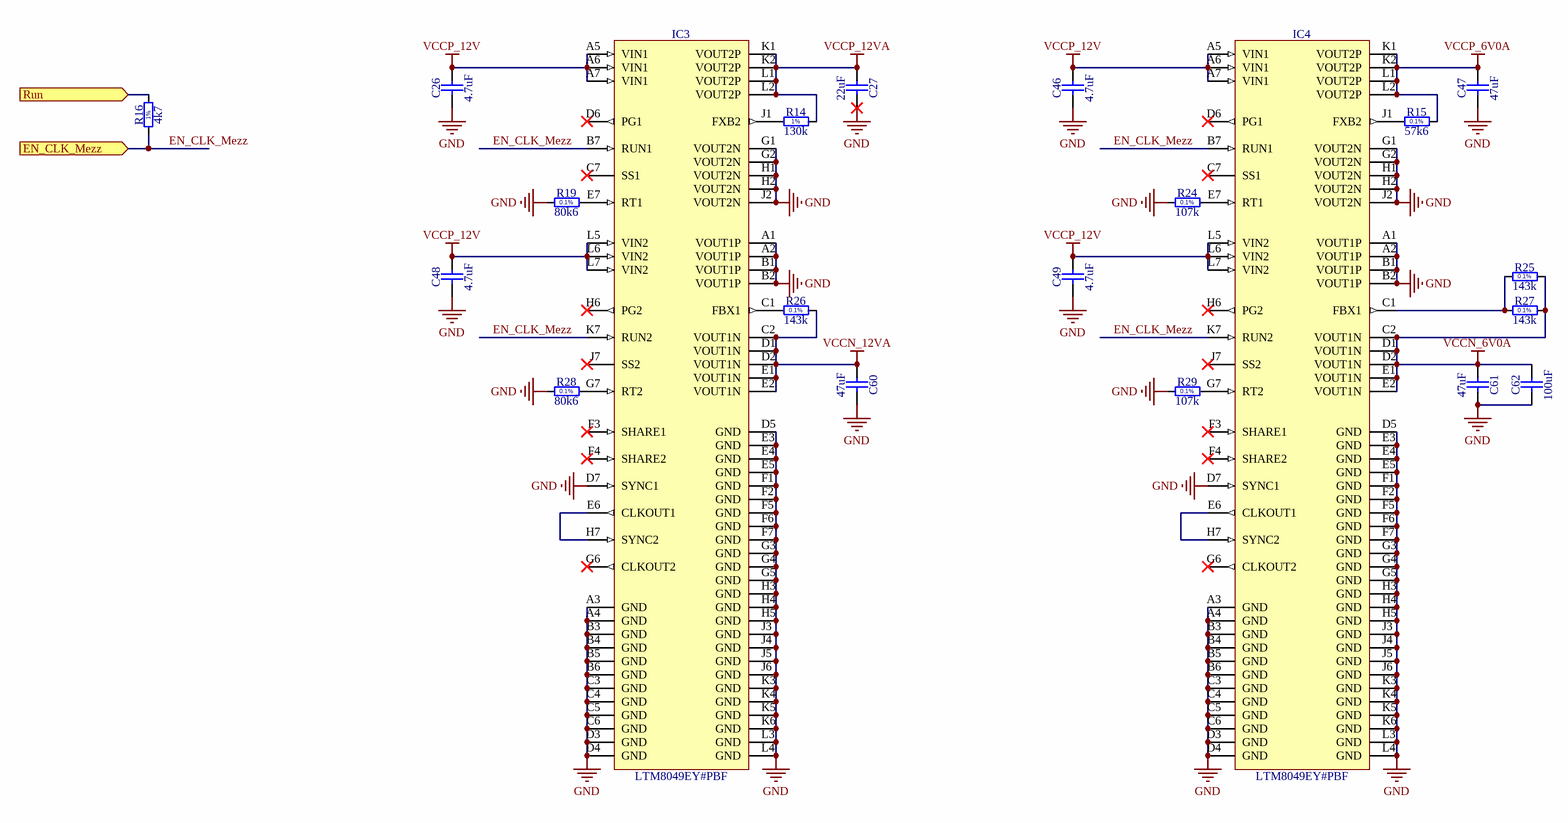
[diagram p11: PowerSupply4ClkMezzanine.SchDoc]

### Parts
C26  4.7uF  [CAPC1709X95N]
C27  22uF  [CAPC3225X270N]
C46  4.7uF  [CAPC1709X95N]
C47  47uF  [CAPC3216X180N]
C48  4.7uF  [CAPC1709X95N]
C49  4.7uF  [CAPC1709X95N]
C60  47uF  [CAPC3216X180N]
C61  47uF  [CAPC3216X180N]
C62  100uF  [CAPC3216X180N]
IC3  LTM8049EY#PBF  [BGA77C127P7X11_900X1500X262]
IC4  LTM8049EY#PBF  [BGA77C127P7X11_900X1500X262]
R14  130k  [RESC1005X40N]
R15  57k6  [RESC1608X55N]
R16  4k7  [RESC1005X40N]
R19  80k6  [RESC1608X55N]
R24  107k  [RESC1608X55N]
R25  143k  [RESC1608X55N]
R26  143k  [RESC1608X55N]
R27  143k  [RESC1608X55N]
R28  80k6  [RESC1608X55N]
R29  107k  [RESC1608X55N]

### Ports
EN_CLK_Mezz (in), Run (in)

### Nets
GND: C26.1 C27.2 C46.1 C47.1 C48.1 C49.1 C60.2 C61.2 C62.1 IC3.A1(VOUT1P) IC3.A2(VOUT1P) IC3.A3(GND) IC3.A4(GND) IC3.B1(VOUT1P) IC3.B2(VOUT1P) IC3.B3(GND) IC3.B4(GND) IC3.B5(GND) IC3.B6(GND) IC3.C3(GND) IC3.C4(GND) IC3.C5(GND) IC3.C6(GND) IC3.D3(GND) IC3.D4(GND) IC3.D5(GND) IC3.D7(SYNC1) IC3.E3(GND) IC3.E4(GND) IC3.E5(GND) IC3.F1(GND) IC3.F2(GND) IC3.F5(GND) IC3.F6(GND) IC3.F7(GND) IC3.G1(VOUT2N) IC3.G2(VOUT2N) IC3.G3(GND) IC3.G4(GND) IC3.G5(GND) IC3.H1(VOUT2N) IC3.H2(VOUT2N) IC3.H3(GND) IC3.H4(GND) IC3.H5(GND) IC3.J2(VOUT2N) IC3.J3(GND) IC3.J4(GND) IC3.J5(GND) IC3.J6(GND) IC3.K3(GND) IC3.K4(GND) IC3.K5(GND) IC3.K6(GND) IC3.L3(GND) IC3.L4(GND) IC4.A1(VOUT1P) IC4.A2(VOUT1P) IC4.A3(GND) IC4.A4(GND) IC4.B1(VOUT1P) IC4.B2(VOUT1P) IC4.B3(GND) IC4.B4(GND) IC4.B5(GND) IC4.B6(GND) IC4.C3(GND) IC4.C4(GND) IC4.C5(GND) IC4.C6(GND) IC4.D3(GND) IC4.D4(GND) IC4.D5(GND) IC4.D7(SYNC1) IC4.E3(GND) IC4.E4(GND) IC4.E5(GND) IC4.F1(GND) IC4.F2(GND) IC4.F5(GND) IC4.F6(GND) IC4.F7(GND) IC4.G1(VOUT2N) IC4.G2(VOUT2N) IC4.G3(GND) IC4.G4(GND) IC4.G5(GND) IC4.H1(VOUT2N) IC4.H2(VOUT2N) IC4.H3(GND) IC4.H4(GND) IC4.H5(GND) IC4.J2(VOUT2N) IC4.J3(GND) IC4.J4(GND) IC4.J5(GND) IC4.J6(GND) IC4.K3(GND) IC4.K4(GND) IC4.K5(GND) IC4.K6(GND) IC4.L3(GND) IC4.L4(GND) R19.1 R24.1 R28.1 R29.1
VCCN_6V0A: C61.1 C62.2 IC4.C2(VOUT1N) IC4.D1(VOUT1N) IC4.D2(VOUT1N) IC4.E1(VOUT1N) IC4.E2(VOUT1N) R25.2 R27.2
VCCN_12VA: C60.1 IC3.C2(VOUT1N) IC3.D1(VOUT1N) IC3.D2(VOUT1N) IC3.E1(VOUT1N) IC3.E2(VOUT1N) R26.2
VCCP_6V0A: C47.2 IC4.K1(VOUT2P) IC4.K2(VOUT2P) IC4.L1(VOUT2P) IC4.L2(VOUT2P) R15.2
VCCP_12V: C26.2 C46.2 C48.2 C49.2 IC3.A5(VIN1) IC3.A6(VIN1) IC3.A7(VIN1) IC3.L5(VIN2) IC3.L6(VIN2) IC3.L7(VIN2) IC4.A5(VIN1) IC4.A6(VIN1) IC4.A7(VIN1) IC4.L5(VIN2) IC4.L6(VIN2) IC4.L7(VIN2)
VCCP_12VA: C27.1 IC3.K1(VOUT2P) IC3.K2(VOUT2P) IC3.L1(VOUT2P) IC3.L2(VOUT2P) R14.2
EN_CLK_Mezz: IC3.B7(RUN1) IC3.K7(RUN2) IC4.B7(RUN1) IC4.K7(RUN2) R16.1 ; port EN_CLK_Mezz
RUN: R16.2 ; port Run
NetIC3_C1: IC3.C1(FBX1) R26.1
NetIC3_E6: IC3.E6(CLKOUT1) IC3.H7(SYNC2)
NetIC3_E7: IC3.E7(RT1) R19.2
NetIC3_G7: IC3.G7(RT2) R28.2
NetIC3_J1: IC3.J1(FXB2) R14.1
NetIC4_C1: IC4.C1(FBX1) R25.1 R27.1
NetIC4_E6: IC4.E6(CLKOUT1) IC4.H7(SYNC2)
NetIC4_E7: IC4.E7(RT1) R24.2
NetIC4_G7: IC4.G7(RT2) R29.2
NetIC4_J1: IC4.J1(FXB2) R15.1

Not connected (* = marked no-connect by the designer): IC3 C7(SS1)* D6(PG1)* F3(SHARE1)* F4(SHARE2)* G6(CLKOUT2)* H6(PG2)* J7(SS2)*; IC4 C7(SS1)* D6(PG1)* F3(SHARE1)* F4(SHARE2)* G6(CLKOUT2)* H6(PG2)* J7(SS2)*

### Notes on the sheet
- Project/Equipment
- Document
- Designer
- Drawn by
- Check.by
- File
- Last Mod.
- Print Date
- Sheet
- Size
- A3
- of
- Rev
- (in symbol R0402_4K7_1%_0.0625W_100PPM) 1%
- (in symbol R0402_130K_1%_0.0625W_100PPM) 1%
- (in symbol R0603_57K6_0.1%_0.063W_10PPM) 0.1%
- (in symbol R0603_80K6_0.1%_0.063W_10PPM) 0.1%
- (in symbol R0603_107K_0.1%_0.063W_10PPM) 0.1%
- (in symbol R0603_143K_0.1%_0.063W_10PPM) 0.1%

### Library data of the parts
C26 C46 C48 C49 = CC0603_4.7UF_16V_10%_X5R: Non-polarised capacitor; Part Description: SMD Multilayer Chip Ceramic Capacitor; Manufacturer: GENERIC; Manufacturer1 Part Number: EMK107ABJ475KA-T; Voltage: 16V; TC: X5R; Tolerance: ±10%; Part Number: CC0603_4.7UF_16V_10%_X5R; Component Kind: Standard; Component Type: Standard; Pin Count: 2; Value: 4.7uF; Status: None; Manufacturer Part Number: CC0603_4.7UF_16V_10%_X5R; Case: 0603; Mounted: Yes; Socket: No; SMD: Yes; Sense: No; Manufacturer1 Example: TAIYO YUDEN; Manufacturer1 ComponentHeight: 0.95mm; HelpURL: \\cern.ch\dfs\Applications\Altium\Datasheets\CC0603_X7R_TAIYO-YUDEN_HIGH-VALUE.pdf; Author: CERN DEM JLC; CreateDate: 2013-12-16; LatestRevisionDate: 2014-09-16
C27 = CC1210_22UF_25V_10%_X5R: Non-polarised capacitor; Part Description: SMD Multilayer Chip Ceramic Capacitor; Manufacturer: GENERIC; Manufacturer1 Part Number: 12103D226KAT2A; Voltage: 25V; TC: X5R; Tolerance: ±10%; Part Number: CC1210_22UF_25V_10%_X5R; Component Kind: Standard; Component Type: Standard; Pin Count: 2; Value: 22uF; Status: Preferred; Manufacturer Part Number: CC1210_22UF_25V_10%_X5R; Case: 1210; Mounted: Yes; Socket: No; SMD: Yes; Sense: No; Manufacturer1 Example: AVX; Manufacturer1 ComponentHeight: 2.79mm; HelpURL: \\cern.ch\dfs\Applications\Altium\Datasheets\CC1210_X5R_AVX.pdf; Author: CERN DEM JLC; CreateDate: 2014-11-12; LatestRevisionDate: 2014-11-12
C47 C60 C61 = CC1206_47UF_25V_20%_X5R: Non-polarised capacitor; Part Description: SMD Multilayer Chip Ceramic Capacitor; Manufacturer: TDK; Manufacturer Part Number: C3216X5R1E476M160AC; Voltage: 25V; TC: X5R; Tolerance: ±20%; Part Number: CC1206_47UF_25V_20%_X5R; Component Kind: Standard; Component Type: Standard; Pin Count: 2; Value: 47uF; Status: None; Case: 1206; Mounted: Yes; Socket: No; SMD: Yes; Sense: No; ComponentHeight: 1.8mm; HelpURL: \\cern.ch\dfs\Applications\Altium\Datasheets\CC1206_X5R_TDK_C.pdf; Author: CERN DEM JLC; CreateDate: 2013-11-20; LatestRevisionDate: 2013-11-20
C62 = CC1206_100UF_6.3V_20%_X5R: Non-polarised capacitor; Part Description: SMD Multilayer Chip Ceramic Capacitor; Manufacturer: GENERIC; Manufacturer1 Part Number: C1206C107M9PACTU; Voltage: 6.3V; TC: X5R; Tolerance: ±10%; Part Number: CC1206_100UF_6.3V_20%_X5R; Component Kind: Standard; Component Type: Standard; Pin Count: 2; Value: 100uF; Status: None; Manufacturer Part Number: CC1206_100UF_6.3V_20%_X5R; Case: 1206; Mounted: Yes; Socket: No; SMD: Yes; Sense: No; Manufacturer1 Example: KEMET; Manufacturer1 ComponentHeight: 1.8mm; HelpURL: \\cern.ch\dfs\Applications\Altium\Datasheets\CC1206_X5R_KEMET.pdf; Author: CERN DEM JLC; CreateDate: 2012-09-26; LatestRevisionDate: 2012-09-26
IC3 IC4 = LTM8049EY#PBF: Dual SEPIC or Inverting uModule DC/DC Converter; Manufacturer: LINEAR TECHNOLOGY; PressFit: No; Bonding: No; Part Number: LTM8049EY#PBF; Component Kind: Standard; Component Type: Standard; Device: LTM8049EY#PBF; PackageDescription: BGA, 1.27mm Pitch, Rect.; 77 Pin, 7 Columns X 11 Rows, 9.00mm X 15.00mm X 2.62mm H; Part Description: Dual SEPIC or Inverting uModule DC/DC Converter; Manufacturer Part Number: LTM8049EY#PBF; Pin Count: 77; Case: BGA77; Mounted: Yes; Socket: No; SMD: Yes; Sense: No; ComponentHeight: 2.62mm; HelpURL: \\cern.ch\dfs\Applications\Altium\Datasheets\LTM8049EY#PBF.pdf; Author: CERN DEM JLC; CreateDate: 2016-12-08; LatestRevisionDate: 2016-12-08
R14 = R0402_130K_1%_0.0625W_100PPM: Resistor - 1%; Part Description: General Purpose Thick Film Chip Resistor; Manufacturer: GENERIC; Manufacturer1 Part Number: 232270671304L; TC: ±100ppm/°C; Part Number: R0402_130K_1%_0.0625W_100PPM; Component Kind: Standard; Component Type: Standard; Pin Count: 2; Value: 130k; Status: Not recommended; Power: 0.0625W; Tolerance: ±1%; Manufacturer Part Number: R0402_130K_1%_0.0625W_100PPM; Case: 0402; Mounted: Yes; Sense: No; Socket: No; SMD: Yes; Manufacturer1 Example: YAGEO PHYCOMP; Manufacturer1 ComponentHeight: 0.4mm; HelpURL: \\cern.ch\dfs\Applications\Altium\Datasheets\R0402_Phycomp_RC0402.pdf; Author: CERN DEM JLC; CreateDate: 2007-12-03; LatestRevisionDate: 2012-10-17
R15 = R0603_57K6_0.1%_0.063W_10PPM: Resistor - 0.1%; Part Description: Thin Film Chip Resistor; Manufacturer: GENERIC; Manufacturer1 Part Number: RN73C1J57K6BTDF; Power: 0.063W; TC: ±10ppm; Part Number: R0603_57K6_0.1%_0.063W_10PPM; Component Kind: Standard; Component Type: Standard; Pin Count: 2; Value: 57k6; Status: Not recommended; Tolerance: ±0.1%; Manufacturer Part Number: R0603_57K6_0.1%_0.063W_10PPM; Case: 0603; Mounted: Yes; Sense: No; Socket: No; SMD: Yes; Manufacturer1 Example: TYCO HOLSWORTHY; Manufacturer1 ComponentHeight: 0.5mm; HelpURL: \\cern.ch\dfs\Applications\Altium\Datasheets\R0603_Tyco_RN73.pdf; Author: CERN DEM JLC; CreateDate: 2007-12-03; LatestRevisionDate: 2008-03-13
R16 = R0402_4K7_1%_0.0625W_100PPM: as R20 on sheet Signal_distribution; Part Number: R0402_4K7_1%_0.0625W_100PPM; Component Kind: Standard; Component Type: Standard; Pin Count: 2; Value: 4k7; Status: Not recommended; Power: 0.0625W; Tolerance: ±1%; Manufacturer Part Number: R0402_4K7_1%_0.0625W_100PPM; Case: 0402; Mounted: Yes; Sense: No; Socket: No; SMD: Yes; Manufacturer1 Example: YAGEO PHYCOMP; Manufacturer1 ComponentHeight: 0.4mm; HelpURL: \\cern.ch\dfs\Applications\Altium\Datasheets\R0402_Phycomp_RC0402.pdf; Author: CERN DEM JLC; CreateDate: 2007-12-03; LatestRevisionDate: 2012-10-17
R19 R28 = R0603_80K6_0.1%_0.063W_10PPM: Resistor - 0.1%; Part Description: Thin Film Chip Resistor; Manufacturer: GENERIC; Manufacturer1 Part Number: RN73C1J80K6BTDF; Power: 0.063W; TC: ±10ppm; Part Number: R0603_80K6_0.1%_0.063W_10PPM; Component Kind: Standard; Component Type: Standard; Pin Count: 2; Value: 80k6; Status: Not recommended; Tolerance: ±0.1%; Manufacturer Part Number: R0603_80K6_0.1%_0.063W_10PPM; Case: 0603; Mounted: Yes; Sense: No; Socket: No; SMD: Yes; Manufacturer1 Example: TYCO HOLSWORTHY; Manufacturer1 ComponentHeight: 0.5mm; HelpURL: \\cern.ch\dfs\Applications\Altium\Datasheets\R0603_Tyco_RN73.pdf; Author: CERN DEM JLC; CreateDate: 2007-12-03; LatestRevisionDate: 2008-03-13
R24 R29 = R0603_107K_0.1%_0.063W_10PPM: Resistor - 0.1%; Part Description: Thin Film Chip Resistor; Manufacturer: GENERIC; Manufacturer1 Part Number: RN73C1J107KBTDF; Power: 0.063W; TC: ±10ppm; Part Number: R0603_107K_0.1%_0.063W_10PPM; Component Kind: Standard; Component Type: Standard; Pin Count: 2; Value: 107k; Status: Not recommended; Tolerance: ±0.1%; Manufacturer Part Number: R0603_107K_0.1%_0.063W_10PPM; Case: 0603; Mounted: Yes; Sense: No; Socket: No; SMD: Yes; Manufacturer1 Example: TYCO HOLSWORTHY; Manufacturer1 ComponentHeight: 0.5mm; HelpURL: \\cern.ch\dfs\Applications\Altium\Datasheets\R0603_Tyco_RN73.pdf; Author: CERN DEM JLC; CreateDate: 2007-12-03; LatestRevisionDate: 2008-03-13
R25-R27 = R0603_143K_0.1%_0.063W_10PPM: Resistor - 0.1%; Part Description: Thin Film Chip Resistor; Manufacturer: GENERIC; Manufacturer1 Part Number: RN73C1J143KBTDF; Power: 0.063W; TC: ±10ppm; Part Number: R0603_143K_0.1%_0.063W_10PPM; Component Kind: Standard; Component Type: Standard; Pin Count: 2; Value: 143k; Status: Not recommended; Tolerance: ±0.1%; Manufacturer Part Number: R0603_143K_0.1%_0.063W_10PPM; Case: 0603; Mounted: Yes; Sense: No; Socket: No; SMD: Yes; Manufacturer1 Example: TYCO HOLSWORTHY; Manufacturer1 ComponentHeight: 0.5mm; HelpURL: \\cern.ch\dfs\Applications\Altium\Datasheets\R0603_Tyco_RN73.pdf; Author: CERN DEM JLC; CreateDate: 2007-12-03; LatestRevisionDate: 2008-03-13